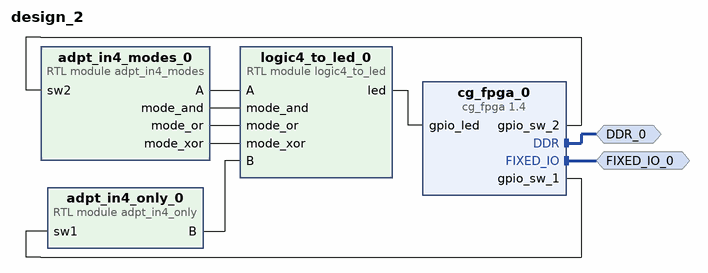
[diagram p0: block diagram of the top level]
# Vivado block design design_2, xc7z020clg400-1, Vivado 2025.1
create_bd_design design_2

create_bd_intf_port -mode Master -vlnv xilinx.com:display_processing_system7:fixedio_rtl:1.0 FIXED_IO_0
create_bd_intf_port -mode Master -vlnv xilinx.com:interface:ddrx_rtl:1.0 DDR_0

create_bd_cell -type ip -vlnv educg.net:user:cg_fpga:1.4 cg_fpga_0
create_bd_cell -type module -reference adpt_in4_only adpt_in4_only_0
create_bd_cell -type module -reference adpt_in4_modes adpt_in4_modes_0
create_bd_cell -type module -reference logic4_to_led logic4_to_led_0

# ---- connections ----

connect_bd_intf_net [get_bd_intf_ports DDR_0] [get_bd_intf_pins cg_fpga_0/DDR]
connect_bd_intf_net [get_bd_intf_ports FIXED_IO_0] [get_bd_intf_pins cg_fpga_0/FIXED_IO]
connect_bd_net [get_bd_pins adpt_in4_modes_0/A] [get_bd_pins logic4_to_led_0/A]
connect_bd_net [get_bd_pins adpt_in4_modes_0/mode_and] [get_bd_pins logic4_to_led_0/mode_and]
connect_bd_net [get_bd_pins adpt_in4_modes_0/mode_or] [get_bd_pins logic4_to_led_0/mode_or]
connect_bd_net [get_bd_pins adpt_in4_modes_0/mode_xor] [get_bd_pins logic4_to_led_0/mode_xor]
connect_bd_net [get_bd_pins adpt_in4_only_0/B] [get_bd_pins logic4_to_led_0/B]
connect_bd_net [get_bd_pins cg_fpga_0/gpio_sw_1] [get_bd_pins adpt_in4_only_0/sw1]
connect_bd_net [get_bd_pins cg_fpga_0/gpio_sw_2] [get_bd_pins adpt_in4_modes_0/sw2]
connect_bd_net [get_bd_pins logic4_to_led_0/led] [get_bd_pins cg_fpga_0/gpio_led]

validate_bd_design
save_bd_design
